# Altium schematic sheet ColorOrgan_LEDs.SchDoc
size A
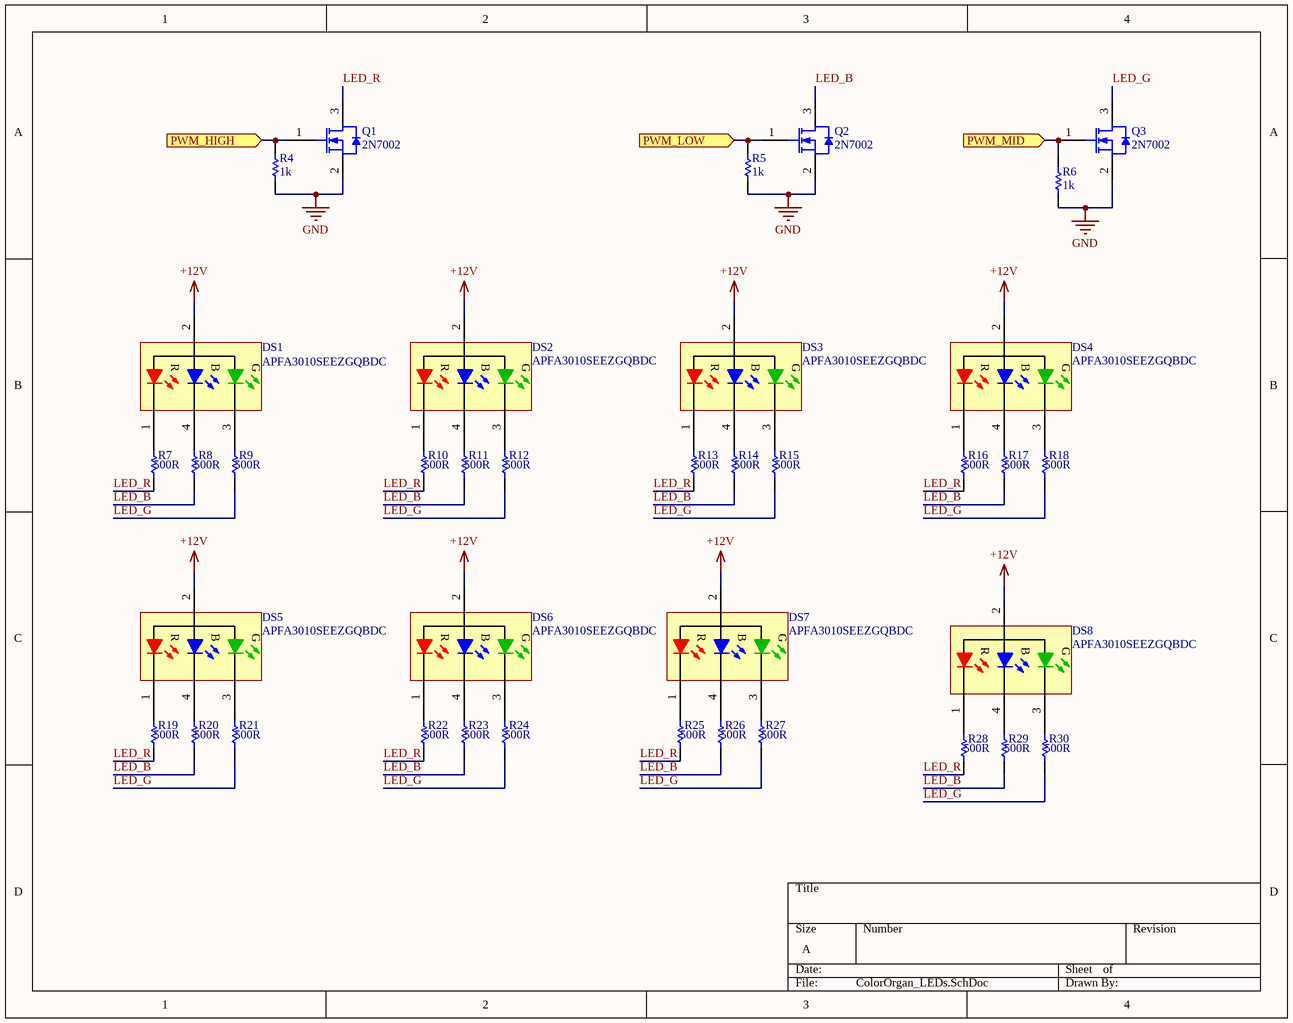
[diagram p0: ColorOrgan_LEDs.SchDoc]

## Parts
DS1  APFA3010SEEZGQBDC  [KING-APFA3010SEEZGQBDC-4_V]
DS2  APFA3010SEEZGQBDC  [KING-APFA3010SEEZGQBDC-4_V]
DS3  APFA3010SEEZGQBDC  [KING-APFA3010SEEZGQBDC-4_V]
DS4  APFA3010SEEZGQBDC  [KING-APFA3010SEEZGQBDC-4_V]
DS5  APFA3010SEEZGQBDC  [KING-APFA3010SEEZGQBDC-4_V]
DS6  APFA3010SEEZGQBDC  [KING-APFA3010SEEZGQBDC-4_V]
DS7  APFA3010SEEZGQBDC  [KING-APFA3010SEEZGQBDC-4_V]
DS8  APFA3010SEEZGQBDC  [KING-APFA3010SEEZGQBDC-4_V]
Q1  2N7002  [STM-SOT-23-3_V]
Q2  2N7002  [STM-SOT-23-3_V]
Q3  2N7002  [STM-SOT-23-3_V]
R4  1k  [RESC0805(2012)_L]
R5  1k  [RESC0805(2012)_L]
R6  1k  [RESC0805(2012)_L]
R7  500R  [RESC0805(2012)_L]
R8  500R  [RESC0805(2012)_L]
R9  500R  [RESC0805(2012)_L]
R10  500R  [RESC0805(2012)_L]
R11  500R  [RESC0805(2012)_L]
R12  500R  [RESC0805(2012)_L]
R13  500R  [RESC0805(2012)_L]
R14  500R  [RESC0805(2012)_L]
R15  500R  [RESC0805(2012)_L]
R16  500R  [RESC0805(2012)_L]
R17  500R  [RESC0805(2012)_L]
R18  500R  [RESC0805(2012)_L]
R19  500R  [RESC0805(2012)_L]
R20  500R  [RESC0805(2012)_L]
R21  500R  [RESC0805(2012)_L]
R22  500R  [RESC0805(2012)_L]
R23  500R  [RESC0805(2012)_L]
R24  500R  [RESC0805(2012)_L]
R25  500R  [RESC0805(2012)_L]
R26  500R  [RESC0805(2012)_L]
R27  500R  [RESC0805(2012)_L]
R28  500R  [RESC0805(2012)_L]
R29  500R  [RESC0805(2012)_L]
R30  500R  [RESC0805(2012)_L]

## Ports
PWM_HIGH (in), PWM_LOW (in), PWM_MID (in)

## Nets
+12V: DS1.2(A) DS2.2(A) DS3.2(A) DS4.2(A) DS5.2(A) DS6.2(A) DS7.2(A) DS8.2(A)
GND: Q1.2(S) Q2.2(S) Q3.2(S) R4.1 R5.1 R6.1
LED_B: Q2.3(D) R8.1 R11.1 R14.1 R17.1 R20.1 R23.1 R26.1 R29.1
LED_G: Q3.3(D) R9.1 R12.1 R15.1 R18.1 R21.1 R24.1 R27.1 R30.1
LED_R: Q1.3(D) R7.1 R10.1 R13.1 R16.1 R19.1 R22.1 R25.1 R28.1
PWM_HIGH: Q1.1(G) R4.2 ; port PWM_HIGH
PWM_LOW: Q2.1(G) R5.2 ; port PWM_LOW
PWM_MID: Q3.1(G) R6.2 ; port PWM_MID
NetDS1_1: DS1.1(R) R7.2
NetDS1_3: DS1.3(G) R9.2
NetDS1_4: DS1.4(B) R8.2
NetDS2_1: DS2.1(R) R10.2
NetDS2_3: DS2.3(G) R12.2
NetDS2_4: DS2.4(B) R11.2
NetDS3_1: DS3.1(R) R13.2
NetDS3_3: DS3.3(G) R15.2
NetDS3_4: DS3.4(B) R14.2
NetDS4_1: DS4.1(R) R16.2
NetDS4_3: DS4.3(G) R18.2
NetDS4_4: DS4.4(B) R17.2
NetDS5_1: DS5.1(R) R19.2
NetDS5_3: DS5.3(G) R21.2
NetDS5_4: DS5.4(B) R20.2
NetDS6_1: DS6.1(R) R22.2
NetDS6_3: DS6.3(G) R24.2
NetDS6_4: DS6.4(B) R23.2
NetDS7_1: DS7.1(R) R25.2
NetDS7_3: DS7.3(G) R27.2
NetDS7_4: DS7.4(B) R26.2
NetDS8_1: DS8.1(R) R28.2
NetDS8_3: DS8.3(G) R30.2
NetDS8_4: DS8.4(B) R29.2

## Library data of the parts
DS1-DS8 = CMP-1226-00001-1: Right Angle SMD Chip LED Lamp, -40 to 85 degC, 4-Pin SMD, RoHS, Reel; Manufacturer: Kingbright; C(Green): 45 pF Typ.; C(Blue): 100 pF Typ.; C(Red): 25 pF Typ.; IR(Blue): 50 uA Max.; IR(Red): 10 uA Max.; ComponentLink1URL: http://www.kingbright.com/; ComponentLink1Description: Manufacturer URL; DatasheetVersion: Rev. 12B; Operating Temperature Range: -40 to 85 degC; ComponentLink2URL: http://www.kingbrightusa.com/images/catalog/spec/APFA3010SEEZGQBDC.pdf; PackageDescription: 4-Pin Surface Mount Device, Body 3 x 1.5 mm, Height 1 mm; Mounting Technology: Surface Mount; ComponentLink3URL: http://www.kingbrightusa.com/images/catalog/spec/APFA3010SEEZGQBDC.pdf; IR(Green): 50 uA Max.; PartNumber: APFA3010SEEZGQBDC; RoHS: TRUE; ComponentLink3Description: Package Specification; ComponentLink2Description: Datasheet; Packing: Reel
Q1-Q3 = CMP-0434-00001-1: N-channel 60 V, 1.8 Ohm, 0.35 A STripFET(TM) II Power MOSFET, SOT23; Manufacturer: STMicroelectronics; PartNumber: 2N7002; ComponentLink2Description: Datasheet; ComponentLink2URL: http://www.st.com/st-web-ui/static/active/en/resource/technical/document/datasheet/CD00005134.pdf; ComponentLink1Description: Manufacturer URL; ComponentLink1URL: http://www.st.com/; DatasheetVersion: Rev. 9, 11/2008; PackageReference: SOT-23; Mounting Technology: Surface Mount; PackageDescription: 3-Pin SOT23, 3.016 x 2.8 mm Body, 0.95 mm Pitch
R4-R30 = CMP-1591-00002-1: 0805 (2012 Metric) Chip Resistor; Case-EIA: 0805; Case-Metric: 2012; PackageReference: RESC0805(2012)
  R7-R30: Value: 500R